# EAGLE design TE2015 Expansion Board (EAGLE 7.7.0)
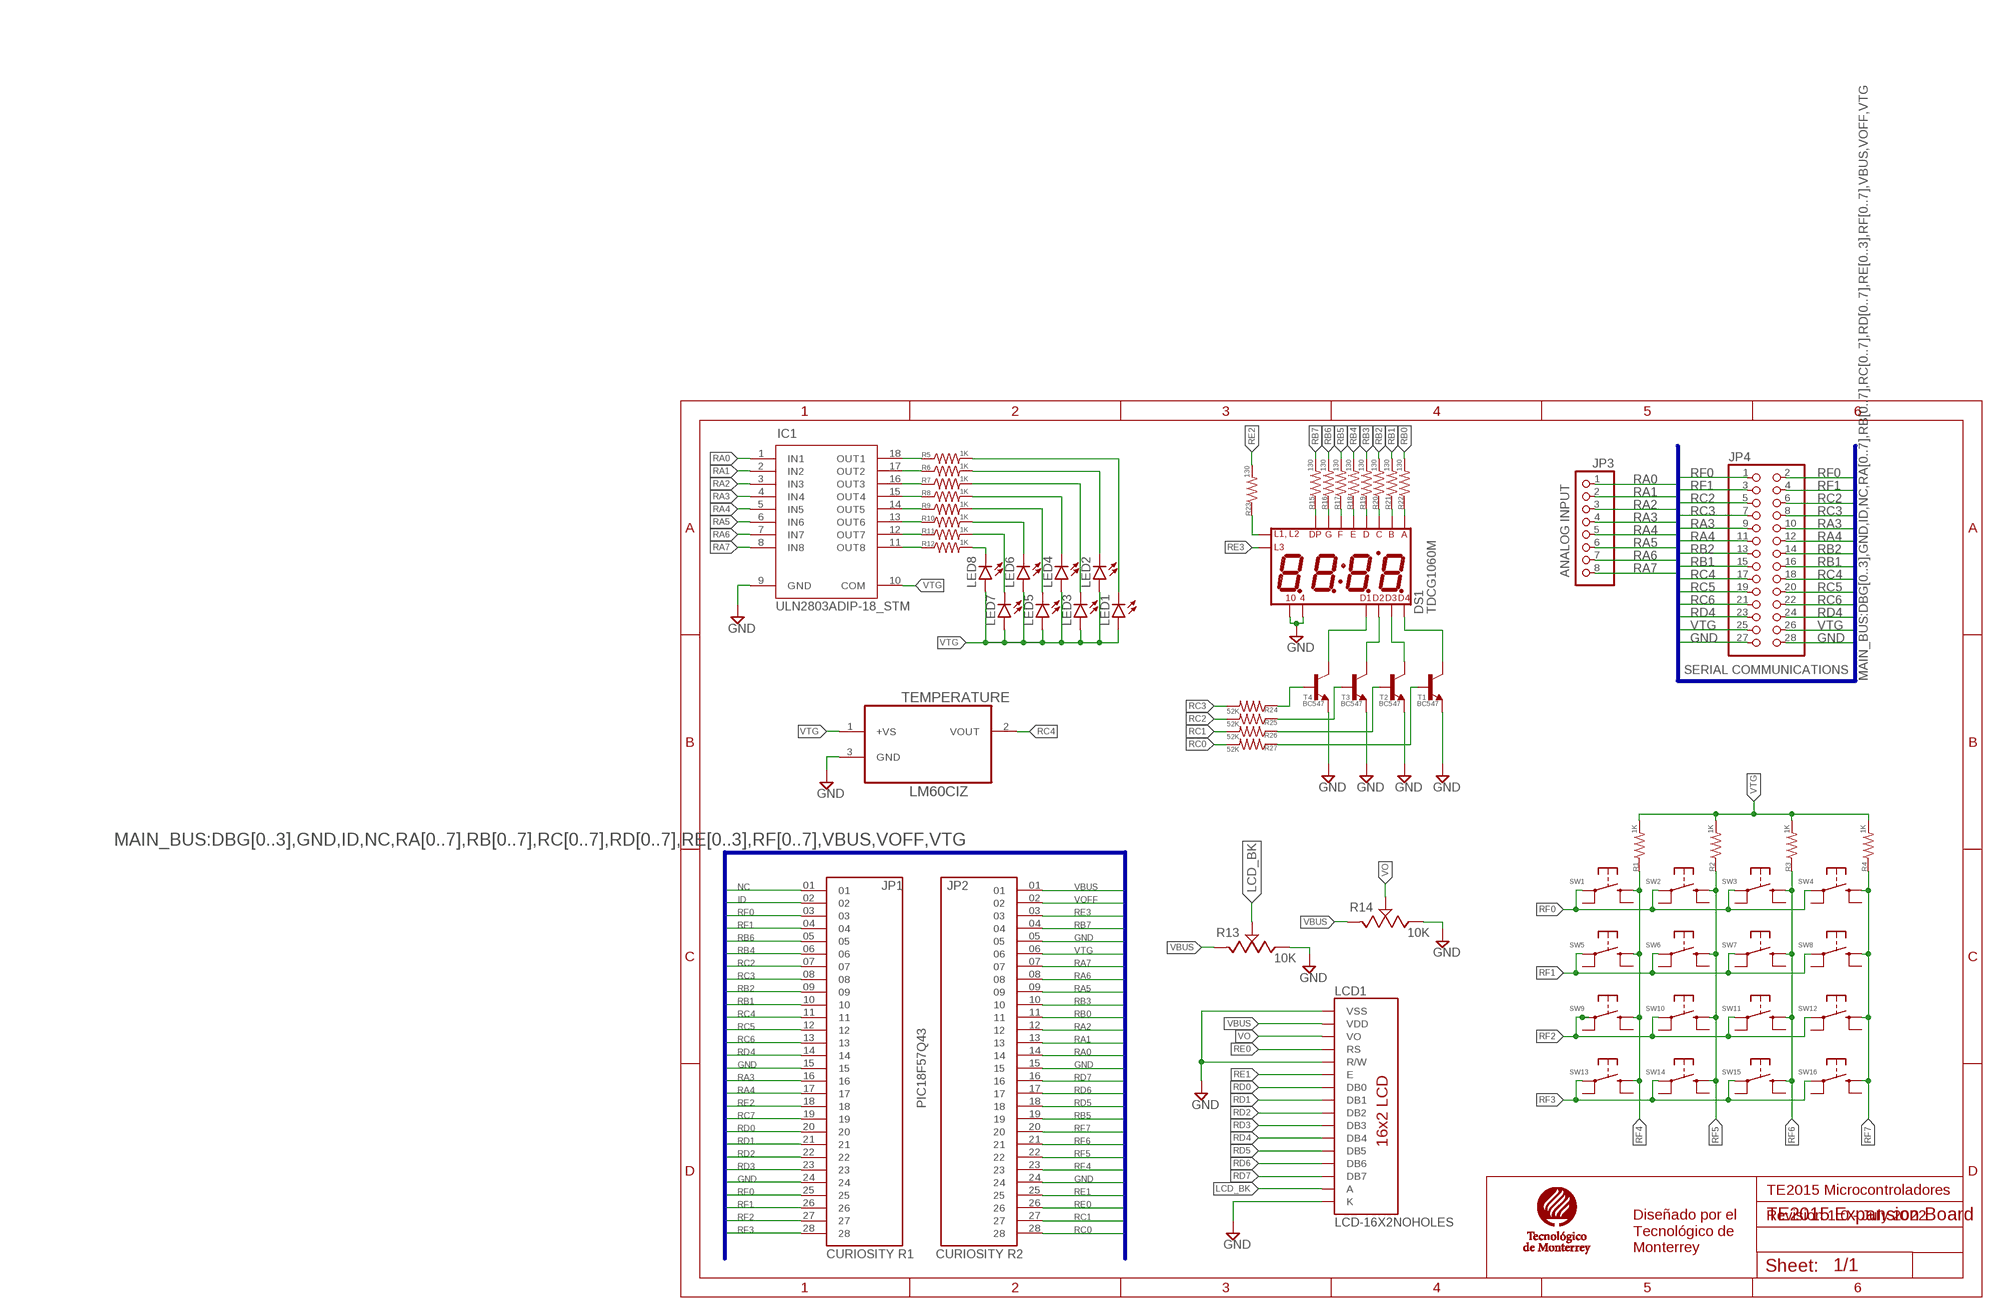
[diagram p0: schematic, sheet 1]

## Parts
DS1  TDCG1060M  [DISPLAY_TDCG1060M]
IC1  ULN2803ADIP-18_STM  [DIP-18_STM]
JP1  CURIOSITY R1  SS-128-T-2  [SAMTEC_SS-128-T-2]
JP2  CURIOSITY R2  SS-128-T-2  [SAMTEC_SS-128-T-2]
JP3  ANALOG INPUT  PINHD-1X8BIG  [1X08-BIG]
JP4  SERIAL COMMUNICATIONS  PINHD-2X14-CB  [2X14-BIG]
LCD1  LCD-16X2NOHOLES  [LCD-16X2_NOHOLESNOSILK]
LED1  LED3MM  [LED3MM]
LED2  LED3MM  [LED3MM]
LED3  LED3MM  [LED3MM]
LED4  LED3MM  [LED3MM]
LED5  LED3MM  [LED3MM]
LED6  LED3MM  [LED3MM]
LED7  LED3MM  [LED3MM]
LED8  LED3MM  [LED3MM]
R1  1K  R-US  [0207/10]
R2  1K  R-US  [0207/10]
R3  1K  R-US  [0207/10]
R4  1K  R-US  [0207/10]
R5  1K  R-US  [0207/10]
R6  1K  R-US  [0207/10]
R7  1K  R-US  [0207/10]
R8  1K  R-US  [0207/10]
R9  1K  R-US  [0207/10]
R10  1K  R-US  [0207/10]
R11  1K  R-US  [0207/10]
R12  1K  R-US  [0207/10]
R13  10K  3362P-1-103LF  [3362P-1-103LF]
R14  10K  3362P-1-103LF  [3362P-1-103LF]
R15  130  R-US  [0207/10]
R16  130  R-US  [0207/10]
R17  130  R-US  [0207/10]
R18  130  R-US  [0207/10]
R19  130  R-US  [0207/10]
R20  130  R-US  [0207/10]
R21  130  R-US  [0207/10]
R22  130  R-US  [0207/10]
R23  130  R-US  [0207/10]
R24  52K  R-US  [0207/10]
R25  52K  R-US  [0207/10]
R26  52K  R-US  [0207/10]
R27  52K  R-US  [0207/10]
SW1  1825910-2  [TE_1825910-2]
SW2  1825910-2  [TE_1825910-2]
SW3  1825910-2  [TE_1825910-2]
SW4  1825910-2  [TE_1825910-2]
SW5  1825910-2  [TE_1825910-2]
SW6  1825910-2  [TE_1825910-2]
SW7  1825910-2  [TE_1825910-2]
SW8  1825910-2  [TE_1825910-2]
SW9  1825910-2  [TE_1825910-2]
SW10  1825910-2  [TE_1825910-2]
SW11  1825910-2  [TE_1825910-2]
SW12  1825910-2  [TE_1825910-2]
SW13  1825910-2  [TE_1825910-2]
SW14  1825910-2  [TE_1825910-2]
SW15  1825910-2  [TE_1825910-2]
SW16  1825910-2  [TE_1825910-2]
T1  BC547  [TO92]
T2  BC547  [TO92]
T3  BC547  [TO92]
T4  BC547  [TO92]
TEC1  TEC_LOGO  [TEC_LOGO]
TEMPERATURE  LM60CIZ  [TO92/]

## Nets
GND [Power]: DS1.4 DS1.10 IC1.9(GND) JP1.15 JP1.24 JP2.05 JP2.15 JP2.24 JP4.27 JP4.28 LCD1.1(VSS) LCD1.5(R/W) LCD1.16(K) R13.3 R14.3 T1.1(E) T2.1(E) T3.1(E) T4.1(E) TEMPERATURE.3(GND)
ID [Signal]: JP1.02
LCD_BK: LCD1.15(A) R13.2
N$1: IC1.18(OUT1) R5.1
N$2: LED8.K(C) R12.2
N$3: LED7.K(C) R11.2
N$4: LED6.K(C) R10.2
N$5: LED5.K(C) R9.2
N$6: LED4.K(C) R8.2
N$7: LED3.K(C) R7.2
N$8: LED2.K(C) R6.2
N$9: DS1.7(DP) R15.1
N$10: DS1.15(G) R16.1
N$11: DS1.11(F) R17.1
N$12: DS1.5(E) R18.1
N$13: DS1.3(D) R19.1
N$14: DS1.13(C) R20.1
N$15: DS1.16(B) R21.1
N$16: DS1.14(A) R22.1
N$17: IC1.17(OUT2) R6.1
N$18: IC1.16(OUT3) R7.1
N$19: LED1.K(C) R5.2
N$20: IC1.15(OUT4) R8.1
N$21: DS1.12(L1_L2) R23.1
N$22: IC1.14(OUT5) R9.1
N$23: IC1.13(OUT6) R10.1
N$24: IC1.12(OUT7) R11.1
N$25: IC1.11(OUT8) R12.1
N$26: DS1.1(DIG1) T4.3(C)
N$27: R24.1 T4.2(B)
N$28: DS1.8(DIG4) T1.3(C)
N$29: DS1.6(DIG3) T2.3(C)
N$30: DS1.2(DIG2) T3.3(C)
N$31: R25.1 T3.2(B)
N$32: R26.1 T2.2(B)
N$33: R27.1 T1.2(B)
NC [Signal]: JP1.01
RA0 [Signal]: IC1.1(IN1) JP2.14 JP3.1
RA1 [Signal]: IC1.2(IN2) JP2.13 JP3.2
RA2 [Signal]: IC1.3(IN3) JP2.12 JP3.3
RA3 [Signal]: IC1.4(IN4) JP1.16 JP3.4 JP4.9 JP4.10
RA4 [Signal]: IC1.5(IN5) JP1.17 JP3.5 JP4.11 JP4.12
RA5 [Signal]: IC1.6(IN6) JP2.09 JP3.6
RA6 [Signal]: IC1.7(IN7) JP2.08 JP3.7
RA7 [Signal]: IC1.8(IN8) JP2.07 JP3.8
RB0 [Signal]: JP2.11 R22.2
RB1 [Signal]: JP1.10 JP4.15 JP4.16 R21.2
RB2 [Signal]: JP1.09 JP4.13 JP4.14 R20.2
RB3 [Signal]: JP2.10 R19.2
RB4 [Signal]: JP1.06 R18.2
RB5 [Signal]: JP2.19 R17.2
RB6 [Signal]: JP1.05 R16.2
RB7 [Signal]: JP2.04 R15.2
RC0 [Signal]: JP2.28 R27.2
RC1 [Signal]: JP2.27 R26.2
RC2 [Signal]: JP1.07 JP4.5 JP4.6 R25.2
RC3 [Signal]: JP1.08 JP4.7 JP4.8 R24.2
RC4 [Signal]: JP1.11 JP4.17 JP4.18 TEMPERATURE.2(VOUT)
RC5 [Signal]: JP1.12 JP4.19 JP4.20
RC6 [Signal]: JP1.13 JP4.21 JP4.22
RC7 [Signal]: JP1.19
RD0 [Signal]: JP1.20 LCD1.7(DB0)
RD1 [Signal]: JP1.21 LCD1.8(DB1)
RD2 [Signal]: JP1.22 LCD1.9(DB2)
RD3 [Signal]: JP1.23 LCD1.10(DB3)
RD4 [Signal]: JP1.14 JP4.23 JP4.24 LCD1.11(DB4)
RD5 [Signal]: JP2.18 LCD1.12(DB5)
RD6 [Signal]: JP2.17 LCD1.13(DB6)
RD7 [Signal]: JP2.16 LCD1.14(DB7)
RE0 [Signal]: JP2.26 LCD1.4(RS)
RE1 [Signal]: JP2.25 LCD1.6(E)
RE2 [Signal]: JP1.18 R23.2
RE3 [Signal]: DS1.9(L3) JP2.03
RF0 [Signal]: JP1.03 JP1.25 JP4.1 JP4.2 SW1.1(P) SW2.1(P) SW3.1(P) SW4.1(P)
RF1 [Signal]: JP1.04 JP1.26 JP4.3 JP4.4 SW5.1(P) SW6.1(P) SW7.1(P) SW8.1(P)
RF2 [Signal]: JP1.27 SW9.1(P) SW10.1(P) SW11.1(P) SW12.1(P)
RF3 [Signal]: JP1.28 SW13.1(P) SW14.1(P) SW15.1(P) SW16.1(P)
RF4 [Signal]: JP2.23 R1.1 SW1.2(S) SW5.2(S) SW9.2(S) SW13.2(S)
RF5 [Signal]: JP2.22 R2.1 SW2.2(S) SW6.2(S) SW10.2(S) SW14.2(S)
RF6 [Signal]: JP2.21 R3.1 SW3.2(S) SW7.2(S) SW11.2(S) SW15.2(S)
RF7 [Signal]: JP2.20 R4.1 SW4.2(S) SW8.2(S) SW12.2(S) SW16.2(S)
VBUS [Power]: JP2.01 LCD1.2(VDD) R13.1 R14.1
VO [Signal]: LCD1.3(VO) R14.2
VOFF [Signal]: JP2.02
VTG [Signal]: IC1.10(COM) JP2.06 JP4.25 JP4.26 LED1.A LED2.A LED3.A LED4.A LED5.A LED6.A LED7.A LED8.A R1.2 R2.2 R3.2 R4.2 TEMPERATURE.1(+VS)
Unconnected: SW1.3(P1) SW1.4(S1) SW2.3(P1) SW2.4(S1) SW3.3(P1) SW3.4(S1) SW4.3(P1) SW4.4(S1) SW5.3(P1) SW5.4(S1) SW6.3(P1) SW6.4(S1) SW7.3(P1) SW7.4(S1) SW8.3(P1) SW8.4(S1) SW9.3(P1) SW9.4(S1) SW10.3(P1) SW10.4(S1) SW11.3(P1) SW11.4(S1) SW12.3(P1) SW12.4(S1) SW13.3(P1) SW13.4(S1) SW14.3(P1) SW14.4(S1) SW15.3(P1) SW15.4(S1) SW16.3(P1) SW16.4(S1)

## Buses
MAIN_BUS:DBG[0..3],GND,ID,NC,RA[0..7],RB[0..7],RC[0..7],RD[0..7],RE[0..3],RF[0..7],VBUS,VOFF,VTG

## Notes on the sheet
- PIC18F57Q43
- TE2015 Microcontroladores
- Revision 1.0 - July 2022
- Diseñado por el 
  Tecnológico de 
  Monterrey

## Library data of the parts
DS1 = TE2015_Microcontroladores:TDCG1060M: Clockmodule 10mm Green m.Plex c.c.-E4; DESCRIPTION: Display Modules - LED Character and Numeric Green 7-Segment Clock 4 Character Common Cathode 2V 20mA 0.504 H x 1.583 W x 0.276 D (12.80mm x 40.20mm x 7.00mm) 16-DIP (0.400, 10.16mm); DIGI-KEY_PART_NUMBER: TDCG1060M-ND; MF: Vishay; MP: TDCG1060M; PACKAGE: None; PURCHASE-URL: https://pricing.snapeda.com/search/part/TDCG1060M/?ref=eda
IC1 = TE2015_Microcontroladores:ULN2803A; COPYRIGHT: Copyright (C) 2022 Ultra Librarian. All rights reserved.; DIGI-KEY_PART_NUMBER_1: 497-2356-5-ND; MANUFACTURER_PART_NUMBER: ULN2803A; MFR_NAME: STMicroelectronics
JP1 JP2 = TE2015_Microcontroladores:SS-128-T-2; DESCRIPTION: 28 Position Receptacle Connector 0.100 (2.54mm) Through Hole Gold; DIGI-KEY_PART_NUMBER: SAM1117-28-ND; MF: Samtec; MP: SS-128-T-2; PACKAGE: None; PURCHASE-URL: https://pricing.snapeda.com/search/part/SS-128-T-2/?ref=eda
JP3 = TE2015_Microcontroladores:PINHD-1X8: PIN HEADER
JP4 = TE2015_Microcontroladores:PINHD-2X14: PIN HEADER
LCD1 = TE2015_Microcontroladores:LCD-16X2: Standard text-only 16x2 parallel input LCD Basic 16 character by 2 line display. Typically utilizes the extremely common HD44780 parallel interface chipset SparkFun Products: Basic 16x2 Green Basic 8x2 Green; SF_ID: LCD-00255
LED1-LED8 = TE2015_Microcontroladores:LED3MM
R1-R12 R15-R27 = TE2015_Microcontroladores:R-US; SPICEPREFIX: R
R13 R14 = TE2015_Microcontroladores:3362P-1-103LF: TRIMMER 10K OHM 0.5W PC PIN TOP Manufacturer's datasheet; CREATED_PN: PCBLayout.com; DIGIKEY_PN: 3362P-103LF-ND; MANUFACTURER: Bourns Inc.; MPN: 3362P-1-103LF
SW1-SW16 = TE2015_Microcontroladores:1825910-2: SWITCH TACTILE SPST-NO 0.05A 24V Check availability; AVAILABILITY: In Stock; COMMENT: 1825910-2; CONFIGURATION_POLE-THROW: Single Pole - Single Throw; CONTACT_CURRENT_RATING: 50 mA; DESCRIPTION: 50 mA SPST Round Actuator 160 Gram Force Tactile Pushbutton Switch; EU_ROHS_COMPLIANCE: Compliant; MF: TE Connectivity; MP: 1825910-2; PACKAGE: None; PRICE: None; PURCHASE-URL: https://pricing.snapeda.com/search/part/1825910-2/?ref=eda
T1-T4 = transistor:BC547: NPN TRANSISTOR
TEC1 = TE2015_Microcontroladores:TEC_LOGO
TEMPERATURE = TE2015_Microcontroladores:LM60CIZ: IC, TEMPERATURE SENSOR, ± 3°C

## Net classes
0 default: width 0.152 mm, drill 0.152 mm, clearance 0.152 mm
1 Power: width 0.305 mm, drill 0.305 mm, clearance 0.305 mm
2 Signal: width 0.152 mm, drill 0.152 mm, clearance 0.152 mm

## Board
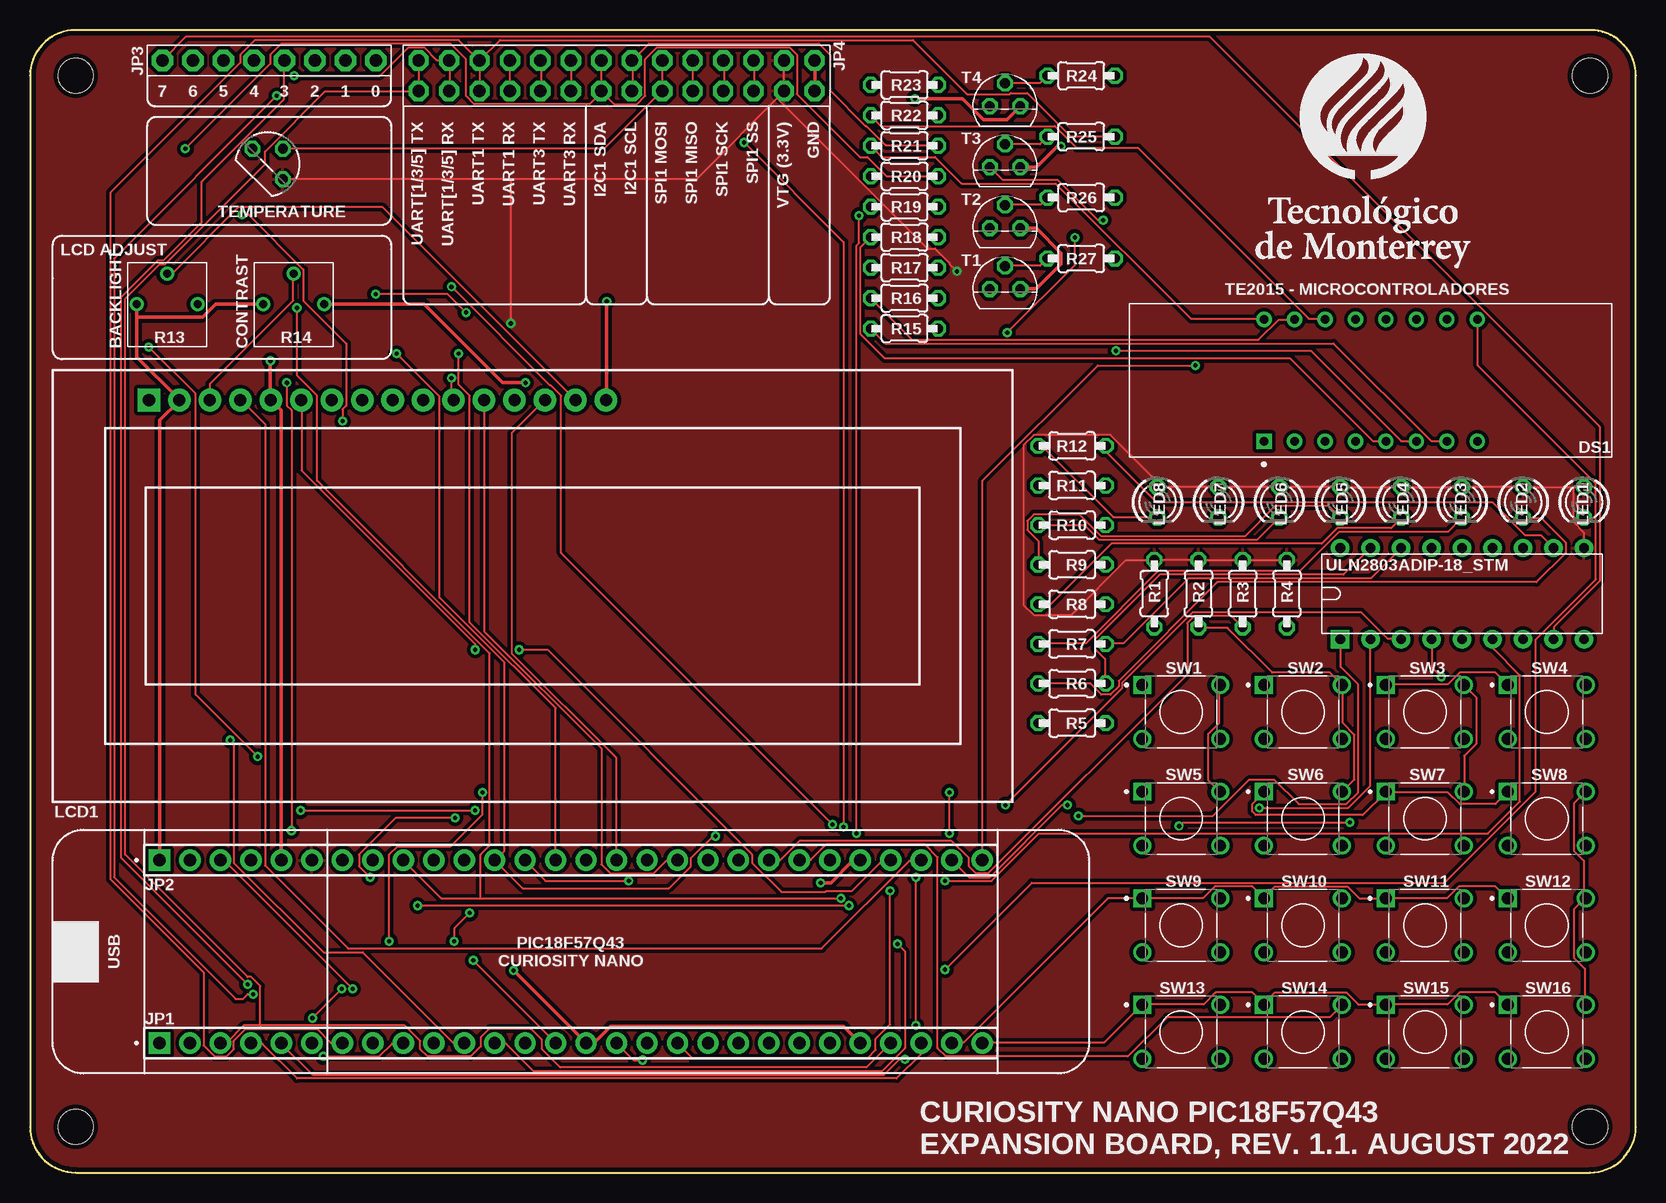
[diagram p1: board, top side]
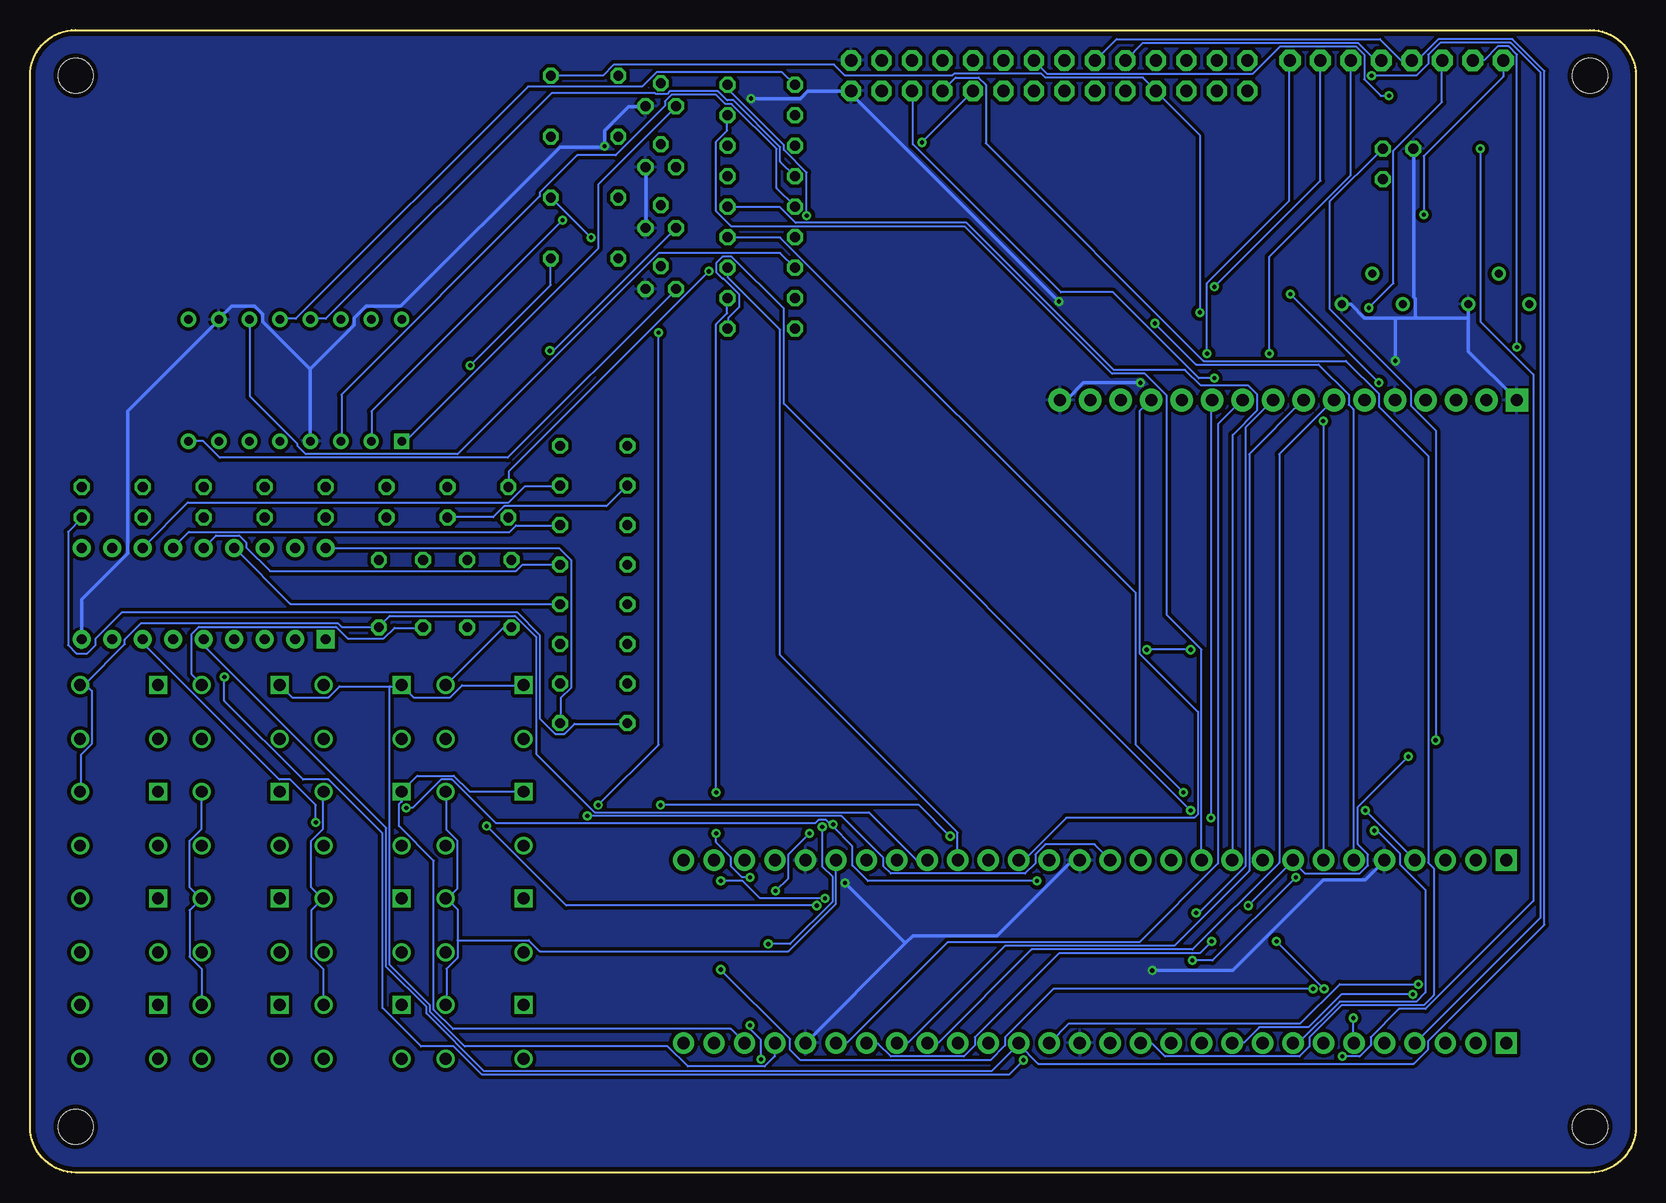
[diagram p2: board, bottom side, seen from below]

Size 133.86 x 95.25 mm. Coordinates in mm from the lower left corner, seen from the top.
Outline: 0,91.44 0,3.81 arc90 3.81,0 130.05,0 130.38,0.01 arc85 133.86,3.81 133.86,91.44 133.84,91.77 arc85 130.05,95.25 3.81,95.25 3.48,95.24 arc85 0,91.44
Copper layers (1*16): Top 0.035mm / dielectric 1.5mm / Bottom 0.035mm
Design rules "default *": minimum track width 6mil, minimum drill 0.35mm, track to track 6mil, track to pad 6mil, pad to pad 6mil, via to via 6mil, smd to smd 6mil, copper to edge 15mil, drill to drill 6mil, minimum pad ring 10mil, minimum via ring 8mil, stop-mask expansion 4mil, vias tented up to drill 0mil, thermal gap 10mil
Holes 2.92 mm at 3.81,3.81 3.81,91.44 130.05,3.81 130.05,91.44

### Footprints (pad centres in the part's own frame; a part is rotated, then mirrored left to right if it is on the bottom)
DISPLAY_TDCG1060M = drill 0.7 pad 1.27 square: 1 -8.89,-5.08 | drill 0.7 pad 1.27: 2 -6.35,-5.08; 3 -3.81,-5.08; 4 -1.27,-5.08; 5 1.27,-5.08; 6 3.81,-5.08; 7 6.35,-5.08; 8 8.89,-5.08; 9 8.89,5.08; 10 6.35,5.08; 11 3.81,5.08; 12 1.27,5.08; 13 -1.27,5.08; 14 -3.81,5.08; 15 -6.35,5.08; 16 -8.89,5.08
DIP-18_STM = drill 0.813 pad 1.524 square: 1 0,0 | drill 0.813 pad 1.524: 2 0,-2.54; 3 0,-5.08; 4 0,-7.62; 5 0,-10.16; 6 0,-12.7; 7 0,-15.24; 8 0,-17.78; 9 0,-20.32; 10 7.62,-20.32; 11 7.62,-17.78; 12 7.62,-15.24; 13 7.62,-12.7; 14 7.62,-10.16; 15 7.62,-7.62; 16 7.62,-5.08; 17 7.62,-2.54; 18 7.62,0
SAMTEC_SS-128-T-2 = drill 1.016 pad 1.778 square: 01 0,0 | drill 1.016 pad 1.778: 02 -2.54,0; 03 -5.08,0; 04 -7.62,0; 05 -10.16,0; 06 -12.7,0; 07 -15.24,0; 08 -17.78,0; 09 -20.32,0; 10 -22.86,0; 11 -25.4,0; 12 -27.94,0; 13 -30.48,0; 14 -33.02,0; 15 -35.56,0; 16 -38.1,0; 17 -40.64,0; 18 -43.18,0; 19 -45.72,0; 20 -48.26,0; 21 -50.8,0; 22 -53.34,0; 23 -55.88,0; 24 -58.42,0; 25 -60.96,0; 26 -63.5,0; 27 -66.04,0; 28 -68.58,0
1X08-BIG = drill 1.016 pad 1.778 octagon: 1 -8.89,0; 2 -6.35,0; 3 -3.81,0; 4 -1.27,0; 5 1.27,0; 6 3.81,0; 7 6.35,0; 8 8.89,0
2X14-BIG = drill 1.016 pad 1.676 octagon: 1 -16.51,-1.27; 2 -16.51,1.27; 3 -13.97,-1.27; 4 -13.97,1.27; 5 -11.43,-1.27; 6 -11.43,1.27; 7 -8.89,-1.27; 8 -8.89,1.27; 9 -6.35,-1.27; 10 -6.35,1.27; 11 -3.81,-1.27; 12 -3.81,1.27; 13 -1.27,-1.27; 14 -1.27,1.27; 15 1.27,-1.27; 16 1.27,1.27; 17 3.81,-1.27; 18 3.81,1.27; 19 6.35,-1.27; 20 6.35,1.27; 21 8.89,-1.27; 22 8.89,1.27; 23 11.43,-1.27; 24 11.43,1.27; 25 13.97,-1.27; 26 13.97,1.27; 27 16.51,-1.27; 28 16.51,1.27
LCD-16X2_NOHOLESNOSILK = drill 1.016 pad 1.88 square: 1 -32,15.5 | drill 1.016 pad 1.88: 2 -29.46,15.5; 3 -26.92,15.5; 4 -24.38,15.5; 5 -21.84,15.5; 6 -19.3,15.5; 7 -16.76,15.5; 8 -14.22,15.5; 9 -11.68,15.5; 10 -9.14,15.5; 11 -6.6,15.5; 12 -4.06,15.5; 13 -1.52,15.5; 14 1.02,15.5; 15 3.56,15.5; 16 6.1,15.5
LED3MM = drill 0.813 octagon: A -1.27,0; K 1.27,0
0207/10 = drill 0.813 octagon: 1 -1.54,0; 2 4.08,0
3362P-1-103LF = drill 0.66: 1 -2.54,0; 2 0,2.54; 3 2.54,0
TE_1825910-2 = drill 0.99 square: 1 0,0 | drill 0.99: 2 6.5,0; 3 0,-4.5; 4 6.5,-4.5
TO92 = drill 0.813 octagon: 1 1.27,0; 2 0,1.905; 3 -1.27,0
TO92/ = drill 0.813 octagon: 1 1.27,-1.27; 2 1.27,1.27; 3 -1.27,1.27

### Placement (x,y rotation side)
DS1  111.76,66.04 0 top
IC1  109.22,44.45 90 top
JP1  10.79,10.79 180 top
JP2  10.79,26.04 180 top
JP3  19.94,92.71 180 top
JP4  48.9,91.44 0 top
LCD1  41.91,48.9 0 top
LED1  129.54,55.88 270 top
LED2  124.46,55.88 270 top
LED3  119.38,55.88 270 top
LED4  114.3,55.88 270 top
LED5  109.22,55.88 270 top
LED6  104.14,55.88 270 top
LED7  99.06,55.88 270 top
LED8  93.98,55.88 270 top
R1  93.73,46.99 90 top
R2  97.41,46.99 90 top
R3  101.09,46.99 90 top
R4  104.78,46.99 90 top
R5  88.14,37.47 180 top
R6  88.14,40.77 180 top
R7  88.14,44.07 180 top
R8  88.14,47.37 180 top
R9  88.14,50.67 180 top
R10  88.14,53.98 180 top
R11  88.14,57.28 180 top
R12  88.14,60.58 180 top
R13  11.43,72.39 0 top
R14  21.97,72.39 0 top
R15  71.63,70.36 0 top
R16  71.63,72.9 0 top
R17  71.63,75.44 0 top
R18  71.63,77.98 0 top
R19  71.63,80.52 0 top
R20  71.63,83.06 0 top
R21  71.63,85.6 0 top
R22  71.63,88.14 0 top
R23  71.63,90.68 0 top
R24  86.36,91.44 0 top
R25  86.36,86.36 0 top
R26  86.36,81.28 0 top
R27  86.36,76.2 0 top
SW1  92.71,40.64 0 top
SW2  102.87,40.64 0 top
SW3  113.03,40.64 0 top
SW4  123.19,40.64 0 top
SW5  92.71,31.75 0 top
SW6  102.87,31.75 0 top
SW7  113.03,31.75 0 top
SW8  123.19,31.75 0 top
SW9  92.71,22.86 0 top
SW10  102.87,22.86 0 top
SW11  113.03,22.86 0 top
SW12  123.19,22.86 0 top
SW13  92.71,13.97 0 top
SW14  102.87,13.97 0 top
SW15  113.03,13.97 0 top
SW16  123.19,13.97 0 top
T1  81.28,73.66 0 top
T2  81.28,78.74 0 top
T3  81.28,83.82 0 top
T4  81.28,88.9 0 top
TEC1  100.97,74.17 0 top
TEMPERATURE  19.81,84.07 0 top

### Tracks (layer width: path | path; a pad name or v marks a point on that pad's centre or on a via)
GND  (via drill 0.35)
  Top 0.305: JP4.27 65.46,90.22 65.46,92.66 JP4.28 | T1.1 82.6,73.69 83.9,73.69 85.95,75.74 85.95,76.66 83.9,78.72 82.6,78.72 T2.1 | v85.95,85.57 85.65,85.57 83.9,83.82 82.6,83.82 T3.1 | v73.76,89.53 77.72,89.53 79.48,87.78 81.46,87.78 82.53,88.85 T4.1 | v41.3,65.84 39.4,65.84 32.84,72.39 24.54,72.39 R14.3 | JP1.24 69.19,10.82 67.82,12.19 48.39,12.19 47.02,10.82 46.41,10.82 JP1.15 46.25,10.9 v40.31,16.84 | v65.91,24.16 66.75,24.16 68.58,25.98 69.19,25.98 JP2.24 | JP2.05 20.95,26.06 20.95,63.55 20.12,64.39 LCD1.5 20.04,64.54 v20.04,67.67 | v48.08,72.62 48.08,64.47 LCD1.16
  Bottom 0.305: T3.1 82.53,83.82 82.53,78.79 T2.1 | T4.1 82.6,88.85 83.97,88.85 85.95,86.87 v85.95,85.57 86.03,85.5 89.69,85.5 102.95,72.24 105.84,72.24 106.83,71.25 106.83,70.64 110.41,67.06 110.49,66.98 | v73.76,89.53 69.65,89.53 69.04,90.14 65.46,90.14 JP4.27 65.46,89.99 v48.08,72.62 | 110.49,66.98 DS1.4 | 110.49,66.98 114.45,70.94 114.45,71.55 115.14,72.24 117.04,72.24 118.11,71.17 DS1.10 118.19,71.02 125.73,63.48 125.73,51.59 129.54,47.78 129.54,44.5 IC1.9 | 13.95,71.25 13.95,68.43 9.98,64.47 LCD1.1 | 13.95,71.25 13.95,72.39 R13.3 | 18.36,71.25 14.02,71.25 13.95,71.25 | 18.36,71.25 20.04,71.25 | 20.04,71.25 22.63,71.25 23.77,72.39 24.46,72.39 R14.3 | TEMPERATURE.3 18.52,85.34 18.52,73 18.36,72.85 18.36,71.32 18.36,71.25 | v41.3,65.84 46.02,65.84 47.4,64.47 48.01,64.47 LCD1.16 | 60.88,19.13 69.19,10.82 JP1.24 | 60.88,19.13 60.27,19.74 53.26,19.74 47.02,25.98 46.41,25.98 JP2.15 | v65.91,24.16 60.96,19.2 60.88,19.13 | v40.31,16.84 33.6,16.84 26.06,24.38 22.55,24.38 20.95,25.98 JP2.05 | v20.04,67.67 20.04,71.17 20.04,71.25
  pour Bottom (isolate 0.305): 0,91.44 arc-90 3.81,95.25 130.05,95.25 arc-90 133.86,91.44 133.86,3.81 arc-90 130.05,0 3.81,0 arc-90 0,3.81
LCD_BK
  Top 0.152: R13.2 11.43,74.98 11.89,74.98 17.37,80.47 29.41,80.47 45.41,64.47 LCD1.15
N$1
  Bottom 0.152: R5.1 89.61,37.49 89.61,39.55 88.77,40.39 88.77,51.05 89.76,52.05 109.19,52.05 IC1.18
N$2
  Top 0.152: LED8.K 93.95,54.63 90.3,54.63 84.35,60.58 84.12,60.58 R12.2
N$3
  Bottom 0.152: LED7.K 99.06,54.63 95.25,54.63 94.34,55.55 85.8,55.55 84.12,57.23 R11.2
N$4
  Top 0.152: R10.2 84.12,53.95 87.94,53.95 89.15,52.73 102.26,52.73 104.09,54.56 LED6.K
N$5
  Top 0.152: R9.2 84.05,52.65 83.13,53.57 83.13,54.33 83.67,54.86 87.48,54.86 89.31,53.03 101.27,53.03 103.78,55.55 108.28,55.55 109.19,54.63 LED5.K
N$6
  Top 0.152: R8.2 84.12,47.4 85.11,47.4 90.14,52.43 107.67,52.43 108.97,53.72 113.46,53.72 114.3,54.56 LED4.K
N$7
  Top 0.152: R7.2 84.12,44.12 88.01,44.12 94.03,50.14 105.84,50.14 109.12,53.42 118.19,53.42 119.33,54.56 LED3.K
N$8
  Top 0.152: R6.2 84.12,40.77 88.39,40.77 89.31,39.85 90.07,39.85 90.75,40.54 90.75,41 98.98,49.23 125.58,49.23 128.02,51.66 128.02,52.5 125.96,54.56 124.51,54.56 LED2.K
N$9
  Top 0.152: DS1.7 116.81,60.96 108.66,69.11 71.32,69.11 70.1,70.33 R15.1
N$10
  Top 0.152: DS1.15 105.39,71.09 104.09,71.09 102.41,69.42 73.53,69.42 70.1,72.85 R16.1
N$11
  Bottom 0.152: DS1.11 115.52,71.09 115.52,64.69 111.56,60.73 111.56,60.58 110.87,59.89 98.22,59.89 81.46,76.66 71.32,76.66 70.1,75.44 R17.1
N$12
  Top 0.152: DS1.5 113,60.96 111.94,60.96 105,67.89 71.25,67.89 69.19,69.95 69.19,77.11 70.03,77.95 R18.1
N$13
  Bottom 0.152: DS1.3 107.9,60.96 107.9,64.85 91.36,81.38 91.36,81.69 88.24,84.81 85.04,84.81 80.92,88.92 80.92,89.31 80.39,89.84 76.66,89.84 75.89,89.08 75.36,89.08 71.63,85.34 71.63,82.07 70.1,80.54 R19.1
N$14
  Bottom 0.152: DS1.13 110.49,71.17 109.19,71.17 90.37,89.99 81.76,89.99 81.69,89.92 80.77,89.92 80.54,90.14 76.5,90.14 75.74,89.38 75.21,89.38 71.32,85.5 71.32,84.28 70.1,83.06 R20.1
N$15
  Top 0.152: DS1.16 102.87,71.17 96.77,71.17 85.5,82.45 77.65,82.45 75.44,84.66 71.02,84.66 70.1,85.57 R21.1
N$16
  Top 0.152: DS1.14 107.9,71.17 106.6,71.17 92.35,85.42 87.25,85.42 85.42,87.25 70.94,87.25 70.1,88.09 R22.1
N$17
  Top 0.152: R6.1 89.61,40.77 89.61,42.82 88.77,43.66 88.77,44.42 94.18,49.84 109.5,49.84 111.71,52.05 IC1.17
N$18
  Top 0.152: R7.1 89.69,44.12 91.14,44.12 96.55,49.53 111.78,49.53 114.3,52.05 IC1.16
N$19
  Bottom 0.152: R5.2 84.12,37.41 88.47,37.41 89.31,36.58 90.07,36.58 91.36,37.87 91.36,44.81 93.27,46.71 126.19,46.71 128.4,44.5 128.4,43.97 129.08,43.28 130,43.28 130.68,43.97 130.68,53.42 129.54,54.56 LED1.K
N$20
  Bottom 0.152: R8.1 89.69,47.4 112.17,47.4 116.81,52.05 IC1.15
N$21
  Bottom 0.152: DS1.12 113,71.17 111.71,71.17 92.35,90.53 82.83,90.53 81.61,91.75 71.17,91.75 70.1,90.68 R23.1
N$22
  Bottom 0.152: R9.1 92.81,50.67 93.34,50.14 113.84,50.14 115.82,52.12 115.82,52.5 116.43,53.11 118.34,53.11 119.33,52.12 IC1.14
N$23
  Bottom 0.152: R10.1 89.69,53.95 93.34,53.95 93.88,53.42 120.62,53.42 121.92,52.12 IC1.13
N$24
  Bottom 0.152: R11.1 89.69,57.23 92.58,57.23 93.95,55.85 120.7,55.85 124.44,52.12 IC1.12
N$25
  Top 0.152: R12.1 89.69,60.12 93.95,55.85 121.92,55.85 124.66,53.11 125.96,53.11 126.95,52.12 IC1.11
N$26
  Bottom 0.152: DS1.1 102.56,60.96 86.49,77.04 86.49,82.37 80.01,88.85 T4.3
N$27
  Top 0.152: T4.2 81.31,90.83 84.2,90.83 R24.1
N$28
  Bottom 0.152: DS1.8 120.62,60.96 119.41,60.96 118.03,59.59 94.03,59.59 80.01,73.61 T1.3
N$29  (via drill 0.35)
  Top 0.152: v90.53,68.5 106.76,68.5 114.3,60.96 115.52,60.96 DS1.6
  Bottom 0.152: v90.53,68.5 90.22,68.5 80.01,78.72 T2.3
N$30  (via drill 0.35)
  Top 0.152: v89.46,79.4 89,79.4 85.65,82.75 81.08,82.75 T3.3
  Bottom 0.152: v89.46,79.4 105.39,63.48 105.39,60.96 DS1.2
N$31
  Top 0.152: T3.2 81.31,85.72 84.2,85.72 84.81,86.33 R25.1
N$32
  Top 0.152: T2.2 81.31,80.7 84.28,80.7 84.81,81.23 R26.1
N$33
  Top 0.152: T1.2 81.31,75.59 84.2,75.59 R27.1
RA0  (via drill 0.35)
  Top 0.152: v87.4,29.72 98.6,29.72 101.65,32.77 103.71,32.77 105.77,30.71 109.73,30.71 110.72,31.7 110.72,40.69 109.27,42.14 109.27,44.42 IC1.1 | v35.74,68.28 35.74,65.68 36.65,64.77 36.65,45.87 43.81,38.71 43.81,26.06 JP2.14
  Bottom 0.152: v87.4,29.72 66.22,29.72 62.71,26.21 62.71,25.53 62.1,24.92 50.9,24.92 50.06,25.76 50.06,26.52 49.23,27.36 45.11,27.36 43.81,26.06 JP2.14 | v35.74,68.28 35.74,74.14 28.88,81 28.88,92.66 JP3.1
RA1  (via drill 0.35)
  Top 0.152: v102.49,30.4 109.88,30.4 111.71,32.23 111.71,44.42 IC1.2 | v49.91,24.31 42.98,24.31 41.3,25.98 JP2.13 | v35.13,73.84 43.36,65.61 43.43,65.61 44.27,64.77 44.27,51.66 v66.9,29.03
  Bottom 0.152: v102.49,30.4 101.96,30.4 99.59,32.77 98.68,32.77 95.02,29.11 68.43,29.11 68.12,29.41 67.51,29.41 67.02,28.92 | 67.02,28.92 65.3,27.2 65.3,25.6 64.01,24.31 v49.91,24.31 | v35.13,73.84 26.29,82.68 26.29,92.66 JP3.2 | v66.9,29.03 66.98,28.96 67.02,28.92
RA2  (via drill 0.35)
  Top 0.152: v81.31,30.63 91.06,40.39 91.06,40.84 96.93,46.71 110.95,46.71 113.16,44.5 114.3,44.5 IC1.3 | v57.15,28.04 56.92,28.04 55.09,26.21 55.09,25.53 53.26,23.7 41.07,23.7 38.79,25.98 JP2.12 38.79,26.06 39.55,26.82 39.55,42.52 34.14,47.93 34.14,64.69 v30.56,68.28
  Bottom 0.152: v81.31,30.63 59.74,30.63 v57.15,28.04 | v30.56,68.28 30.56,76.35 23.77,83.13 23.77,92.66 JP3.3
RA3  (via drill 0.35)
  Top 0.152: JP4.9 42.6,90.22 42.6,92.66 JP4.10 | v117.65,41.3 116.89,42.06 116.89,44.42 IC1.4 | v51.05,9.37 50.29,9.37 48.92,10.74 JP1.16 | v18.14,15.7 7.62,26.21 7.62,73 10.67,76.05 11.12,76.05 14.33,79.25 14.33,82.6 21.18,89.46 21.18,92.66 JP3.4
  Bottom 0.152: JP3.4 21.26,92.73 21.72,92.73 23.16,94.18 41.07,94.18 42.52,92.73 JP4.10 | v117.65,41.3 117.65,39.32 111.1,32.77 108.97,32.77 104.47,28.27 104.47,13.72 101.27,10.52 98.53,10.52 96.16,8.15 52.27,8.15 v51.05,9.37 | v18.14,15.7 24.69,15.7 27.96,12.42 47.24,12.42 48.84,10.82 JP1.16
RA4
  Top 0.152: JP4.11 45.11,90.22 45.11,92.66 JP4.12
  Bottom 0.152: 18.67,92.73 19.58,92.73 21.34,94.49 43.28,94.49 45.03,92.73 JP4.12 | 18.67,92.73 JP3.5 18.67,92.73 | IC1.5 119.33,44.42 119.33,43.89 104.17,28.73 104.17,17.14 100.81,13.79 100.81,13.26 96.01,8.46 53.72,8.46 51.44,10.74 JP1.17 51.44,10.67 49.84,9.07 18.52,9.07 17.3,10.29 17.3,10.97 7.62,20.65 7.62,91.82 10.29,94.49 16.46,94.49 18.21,92.73 18.67,92.73
RA5  (via drill 0.35)
  Top 0.152: v76.28,24.31 80.16,24.31 84.12,28.27 121.54,28.27 124.21,30.94 124.21,41.45 121.92,43.74 121.92,44.42 IC1.6 | 37.57,22.86 34.29,22.86 31.17,25.98 JP2.09 | 37.57,22.86 v67.59,22.86 | v22.25,72.08 22.25,66.45 23.93,64.77 23.93,57.68 38.33,43.28 38.33,27.28 37.57,26.52 37.57,22.86
  Bottom 0.152: v76.28,24.31 74.45,24.31 73,22.86 v67.59,22.86 | v22.25,72.08 20.19,74.14 20.19,85.19 16.15,89.23 16.15,92.66 JP3.6
RA6  (via drill 0.35)
  Top 0.152: v110.03,29.18 96.09,29.18 v95.78,28.88 | v32.31,22.25 v68.28,22.25 | v9.91,68.81 13.79,64.92 13.79,39.85 v18.97,34.67
  Bottom 0.152: v110.03,29.18 110.03,30.63 112.17,32.77 113.08,32.77 124.44,44.12 124.44,44.42 IC1.7 | v95.78,28.88 89.15,22.25 v68.28,22.25 | v32.31,22.25 28.57,25.98 JP2.08 28.57,25.91 27.58,24.92 23.01,24.92 22.33,25.6 22.33,26.52 23.16,27.36 23.16,30.48 v18.97,34.67 | v9.91,68.81 9.91,93.19 10.59,93.88 11.51,93.88 12.65,92.73 13.56,92.73 JP3.7
RA7  (via drill 0.35)
  Top 0.152: IC1.8 127.03,44.5 127.03,45.49 130.84,49.3 130.84,62.18 98.3,94.72 13.03,94.72 11.05,92.73 JP3.8 | v26.06,62.64 26.06,63.63 26.36,63.93 26.36,69.11 22.78,72.69 22.78,75.29 18.21,79.86 v17.68,79.86
  Bottom 0.152: v26.06,62.64 26.06,26.06 JP2.07 | v17.68,79.86 17.68,84.73 11.05,91.36 11.05,92.66 JP3.8
RB0
  Bottom 0.152: R22.2 75.74,88.09 75.74,86.87 76.66,85.95 76.66,80.16 75.36,78.87 55.93,78.87 43.66,66.6 40.92,66.6 39.09,64.77 39.09,46.48 36.2,43.59 36.2,26.06 JP2.11
RB1  (via drill 0.35)
  Top 0.152: R21.2 75.67,85.65 71.32,85.65 69.72,87.25 69.65,87.25 66.67,90.22 66.67,93.19 65.76,94.11 51.59,94.11 50.22,92.73 JP4.16 50.22,92.66 50.22,90.22 JP4.15 | v18.59,14.86 18.14,14.86 17.75,14.48 17.14,14.48 7.01,24.61 7.01,76.2 v20.57,89.76
  Bottom 0.152: v18.59,14.86 24.54,14.86 27.28,12.12 31.39,12.12 32.69,10.82 33.6,10.82 JP1.10 | v20.57,89.76 21.26,89.76 22.63,91.14 22.63,93.19 23.32,93.88 29.64,93.88 31.93,91.59 49.07,91.59 50.14,92.66 JP4.16
RB2  (via drill 0.35)
  Top 0.152: R20.2 75.67,83.06 71.4,83.06 69.8,84.66 69.19,84.66 63.93,89.92 63.93,93.19 63.32,93.8 52.27,93.8 51.28,92.81 51.28,89.76 50.6,89.08 48.69,89.08 47.62,90.14 JP4.13 | JP4.14 47.62,92.66 47.62,90.22 JP4.13 | v24.46,9.68 29.11,9.68 30.18,10.74 31.09,10.74 JP1.09 | v12.95,85.34 20.04,92.43 20.04,93.19 20.95,94.11 35.05,94.11 36.35,92.81 36.35,89.76 37.03,89.08 46.63,89.08 47.62,90.07 JP4.13
  Bottom 0.152: v24.46,9.68 23.01,9.68 22.1,10.59 22.1,11.28 19.74,13.64 17.53,13.64 8.53,22.63 8.53,66.52 12.95,70.94 v12.95,85.34
RB3
  Bottom 0.152: R19.2 75.67,80.47 71.32,80.47 70.03,79.17 55.78,79.17 43.51,66.9 37.57,66.9 36.27,65.61 32.31,65.61 31.55,64.85 31.55,63.55 33.6,61.49 33.6,26.06 JP2.10
RB4  (via drill 0.35)
  Top 0.152: v37.72,31.7 37.72,29.87 35.05,27.2 30.63,27.2 29.95,26.52 v29.95,19.28 | v23.55,12.88 v25.98,15.32
  Bottom 0.152: v37.72,31.7 41.68,35.66 41.68,48.31 71.32,77.95 75.67,77.95 R18.2 | v25.98,15.32 v29.95,19.28 | v23.55,12.88 23.55,10.82 JP1.06
RB5
  Bottom 0.152: R17.2 75.67,75.44 75.67,74.6 71.32,70.26 71.32,43.13 56.54,28.35 56.54,26.06 JP2.19
RB6  (via drill 0.35)
  Top 0.152: v76.66,28.27 v76.66,31.7 | v73.84,12.27 v73.84,24.61 | v72.92,9.45 72.47,9.45 71.17,8.15 23.55,8.15 20.95,10.74 JP1.05
  Bottom 0.152: v76.66,31.7 76.66,70.71 75.74,71.63 75.74,72.85 R16.2 | v76.66,28.27 76.66,27.51 75.44,26.29 75.44,25.53 74.52,24.61 v73.84,24.61 | v73.84,12.27 73.84,11.96 72.92,11.05 v72.92,9.45
RB7  (via drill 0.35)
  Top 0.152: v22.55,30.18 v37.11,30.18
  Bottom 0.152: v37.11,30.18 71.02,64.08 71.02,72.01 75.36,76.35 76.12,76.35 76.66,75.82 76.66,75.06 76.12,74.52 76.05,74.52 74.75,73.23 74.75,72.16 75.67,71.25 75.67,70.41 R15.2 | v22.55,30.18 18.44,26.06 JP2.04
RC0  (via drill 0.35)
  Top 0.152: v97.16,67.28 89,67.28 79.4,57.68 79.4,26.06 JP2.28
  Bottom 0.152: v97.16,67.28 90.45,73.99 R27.2
RC1  (via drill 0.35)
  Top 0.152: v87.1,77.95 87.1,75.67 v81.46,70.03 | v86.49,30.63 86.03,30.63 80.01,24.61 78.26,24.61 76.89,25.98 JP2.27
  Bottom 0.152: v87.1,77.95 90.37,81.23 R26.2 | v81.46,70.03 81.46,35.66 v86.49,30.63
RC2
  Top 0.152: R25.2 90.37,86.41 86.72,86.41 83.13,89.99 81.76,89.99 81.69,89.92 78.11,89.92 73.61,94.41 39.17,94.41 37.49,92.73 JP4.6 | JP4.5 37.49,90.22 37.49,92.66 JP4.6 | JP1.07 25.98,10.82 25.07,10.82 23.93,11.96 17.98,11.96 16.99,10.97 16.99,10.29 16.38,9.68 15.39,9.68 14.48,10.59 14.48,16.69 6.71,24.46 6.71,81.69 17.53,92.51 17.53,93.19 18.75,94.41 35.74,94.41 37.41,92.73 JP4.6
RC3  (via drill 0.35)
  Top 0.152: JP4.8 40.01,92.66 40.01,90.22 JP4.7 | v21.79,28.5 21.79,63.55 21.41,63.93 v21.41,65.84 | v28.8,73.23 34.82,73.23 v36.35,71.7
  Bottom 0.152: R24.2 90.37,91.44 86.11,91.44 85.19,92.35 66.83,92.35 65.91,91.44 57,91.44 56.84,91.59 49.53,91.59 49.23,91.29 41.07,91.29 40.01,90.22 JP4.7 40.01,90.14 36.35,86.49 v36.35,71.7 | v21.79,28.5 21.57,28.5 19.66,26.59 19.66,25.68 17.53,23.55 17.53,15.01 18.29,14.25 24.69,14.25 28.12,10.82 28.57,10.82 JP1.08 | v28.8,73.23 v21.41,65.84
RC4  (via drill 0.35)
  Top 0.152: TEMPERATURE.2 21.11,85.34 47.85,85.34 52.65,90.14 JP4.17 52.73,90.22 52.73,92.66 JP4.18 | v16.69,36.04 16.99,35.74 16.99,25.83 24.46,18.36 27.74,18.36 35.28,10.82 36.2,10.82 JP1.11
  Bottom 0.152: v16.69,36.04 16.69,61.87 18.75,63.93 18.75,65.23 25.53,72.01 25.53,80.92 21.11,85.34 TEMPERATURE.2
RC5  (via drill 0.35)
  Top 0.152: JP4.19 55.24,90.22 55.24,92.66 JP4.20 | v72.31,19.05 72.92,18.44 72.92,10.36 71.02,8.46 41.99,8.46 39.7,10.74 38.79,10.74 JP1.12 | v67.82,28.8 67.82,77.57 v59.51,85.88
  Bottom 0.152: v72.31,19.05 70.48,19.05 66.98,22.55 66.98,24.69 67.82,25.53 v67.82,28.8 | v59.51,85.88 55.24,90.14 JP4.19
RC6
  Top 0.152: JP4.21 57.84,90.22 57.84,92.66 JP4.22
  Bottom 0.152: JP1.13 41.22,10.74 40.31,10.74 39.24,9.68 28.04,9.68 27.2,10.52 27.2,11.28 24.54,13.95 17.68,13.95 16.84,14.78 16.84,25.38 17.3,25.83 17.3,59.74 21.41,63.86 21.41,64.92 24.16,67.67 36.04,67.67 54.18,85.8 54.18,90.68 54.79,91.29 56.69,91.29 57.76,90.22 JP4.21
RD0
  Bottom 0.152: JP1.20 59.05,10.82 58.14,10.82 50.37,18.59 36.96,18.59 29.72,25.83 29.72,59.89 25.22,64.39 LCD1.7
RD1
  Bottom 0.152: JP1.21 61.57,10.82 60.66,10.82 52.58,18.9 38.48,18.9 32.23,25.15 32.23,59.89 27.74,64.39 LCD1.8
RD2  (via drill 0.35)
  Top 0.152: v35.36,19.28 35.36,20.34 v36.65,21.64
  Bottom 0.152: v35.36,19.28 36.35,18.29 48.08,18.29 55.09,11.28 55.09,10.59 56.01,9.68 62.1,9.68 63.17,10.74 64.08,10.74 JP1.22 | v36.65,21.64 36.42,21.64 32.54,25.53 32.54,62.1 30.25,64.39 LCD1.9
RD3
  Bottom 0.152: JP1.23 66.67,10.82 65.76,10.82 57.38,19.2 41.38,19.2 34.82,25.76 34.82,62.41 32.84,64.39 LCD1.10
RD4  (via drill 0.35)
  Top 0.152: JP4.23 60.35,90.22 60.35,92.66 JP4.24 | v36.96,17.68 43.81,10.82 JP1.14 | v28.35,24.61 27.43,25.53 27.43,26.52 30.48,29.57 v35.43,29.57 | v35.13,66.22 35.13,64.62 35.28,64.47 LCD1.11
  Bottom 0.152: v36.96,17.68 35.28,17.68 v28.35,24.61 | v35.43,29.57 35.43,64.31 35.36,64.39 LCD1.11 | v35.13,66.22 36.42,66.22 43.59,73.38 47.93,73.38 60.27,85.72 60.27,90.14 JP4.23
RD5
  Top 0.152: JP2.18 53.95,25.98 53.03,25.98 51.97,24.92 48.39,24.92 47.62,25.68 47.62,35.36 37.87,45.11 37.87,64.39 LCD1.12
RD6
  Bottom 0.152: JP2.17 51.44,26.06 50.98,26.06 47.47,29.57 36.8,29.57 36.5,29.87 36.5,38.41 41.38,43.28 41.38,63.48 40.46,64.39 LCD1.13
RD7
  Top 0.152: JP2.16 48.84,26.06 48.84,34.59 40.16,43.28 40.16,61.65 42.9,64.39 LCD1.14
RE0
  Top 0.152: JP2.26 74.3,25.98 73.3,25.98 65.99,18.67 26.52,18.67 19.58,25.6 19.58,62.41 17.6,64.39 LCD1.4
RE1  (via drill 0.35)
  Top 0.152: v40.77,43.59 43.13,43.59 60.2,26.52 60.2,25.83 62.64,23.39 66.29,23.39 66.37,23.47 68.5,23.47 71.02,25.98 71.7,25.98 JP2.25 | v37.11,43.59 37.11,44.04 22.63,58.52 22.63,64.39 LCD1.6
  Bottom 0.152: v37.11,43.59 v40.77,43.59
RE2  (via drill 0.35)
  Top 0.152: v69.11,79.78 69.11,77.5 68.89,77.27 v68.89,28.27 | v71.7,23.47 71.7,12.34 70.48,11.12 70.48,10.21 69.8,9.53 55.24,9.53 54.03,10.74 JP1.18
  Bottom 0.152: v69.11,79.78 69.11,83.36 71.02,85.27 71.02,85.65 75.67,90.3 75.67,90.68 R23.2 | v68.89,28.27 70.64,26.52 70.64,24.54 v71.7,23.47
RE3  (via drill 0.35)
  Top 0.152: v76.28,16.92 83.52,24.16 117.88,24.16 125.5,31.77 125.5,44.42 130.53,49.45 130.53,57.45 120.7,67.28 120.7,71.09 DS1.9 | v26.9,15.32 16.23,25.98 15.93,25.98 JP2.03
  Bottom 0.152: v76.28,16.92 70.48,11.12 70.48,10.21 69.65,9.37 53.8,9.37 52.58,10.59 52.58,11.28 48.54,15.32 v26.9,15.32
RF0
  Top 0.152: SW3.1 113.08,40.69 118.19,40.69 119.18,41.68 122.15,41.68 123.14,40.69 SW4.1 | JP4.2 32.38,92.66 32.38,90.22 JP4.1 32.38,90.14 24.61,90.14 19.58,85.11 19.58,84.05 11.28,75.74 10.82,75.74 7.92,72.85 7.92,26.52 18.14,16.31 18.44,16.31 19.2,15.54 19.2,12.27 | 19.2,12.27 31.24,12.27 32.54,10.97 32.54,10.29 33.15,9.68 36.73,9.68 37.57,10.52 37.57,11.28 38.25,11.96 41.76,11.96 42.67,11.05 42.67,10.29 44.2,8.76 69.72,8.76 71.7,10.74 JP1.25 | 19.2,12.27 17.83,12.27 16.38,10.82 15.93,10.82 JP1.03
  Bottom 0.152: SW1.1 92.73,40.62 97.84,40.62 98.83,39.62 101.88,39.62 102.87,40.62 SW2.1 102.87,40.54 103.86,40.54 | 103.86,40.54 108.05,40.54 108.97,39.62 112.01,39.62 113,40.62 SW3.1 | 103.86,40.54 103.86,17.3 100.51,13.95 100.51,13.41 97.61,10.52 80.7,10.52 79.02,8.84 72.62,8.84 71.78,9.68 71.78,10.74 JP1.25
RF1  (via drill 0.35)
  Top 0.152: SW8.1 123.14,31.7 122.15,30.71 119.18,30.71 118.19,31.7 113.08,31.7 SW7.1 113,31.7 111.1,29.79 102.18,29.79 101.88,30.1 101.88,30.71 102.87,31.7 SW6.1 | JP4.3 34.98,90.22 34.98,92.66 JP4.4 34.9,92.73 33.91,92.73 32.84,93.8 31.55,93.8 29.18,91.44 v22.02,91.44 | JP1.04 18.44,10.74 19.36,10.74 22.25,7.85 72.24,7.85 74.3,9.91 74.3,10.74 JP1.26
  Bottom 0.152: SW5.1 92.73,31.77 97.23,31.77 98.53,33.07 101.58,33.07 102.87,31.77 SW6.1 102.87,31.7 102.87,30.94 103.1,30.71 103.1,28.88 100.2,25.98 100.2,13.56 98.6,11.96 75.44,11.96 74.3,10.82 JP1.26 | v22.02,91.44 18.29,91.44 17.3,92.43 17.3,93.19 16.31,94.18 10.44,94.18 7.92,91.67 7.92,21.26 18.36,10.82 JP1.04
RF2
  Top 0.152: SW12.1 123.14,22.86 122.15,23.85 119.1,23.85 118.11,22.86 113.08,22.86 SW11.1 113,22.86 110.8,22.86 109.8,23.85 103.78,23.85 102.87,22.94 SW10.1 101.88,23.85 98.75,23.85 97.77,22.86 92.73,22.86 SW9.1 92.66,22.86 89.84,22.86 77.8,10.82 76.89,10.82 JP1.27
RF3
  Top 0.152: SW16.1 123.14,14.02 122.15,15.01 119.18,15.01 118.19,14.02 113.08,14.02 SW15.1 113,14.02 110.72,14.02 109.73,15.01 103.78,15.01 102.87,14.1 SW14.1 102.87,14.02 101.88,15.01 98.83,15.01 97.84,14.02 92.73,14.02 SW13.1 92.66,13.95 89.53,10.82 79.4,10.82 JP1.28
RF4
  Top 0.152: SW1.2 99.14,40.62 99.14,37.49 98.22,36.58 98.22,32.69 99.14,31.77 SW5.2
  Bottom 0.152: R1.1 93.73,45.41 94.41,45.41 99.14,40.69 SW1.2 | 98.22,19.36 98.22,21.95 99.14,22.86 SW9.2 99.06,22.86 98.22,23.7 98.22,27.66 99.14,28.57 99.14,31.7 SW5.2 | 98.22,19.36 98.22,17.91 99.14,16.99 99.14,14.02 SW13.2 | 98.22,19.36 92.28,19.36 91.36,18.44 70.64,18.44 66.67,22.4 66.67,25.98 JP2.23
RF5
  Top 0.152: R2.1 97.46,45.41 99.82,45.41 103.56,41.68 108.36,41.68 109.35,40.69 SW2.2 109.42,40.62 109.42,37.49 110.41,36.5 110.41,32.77 109.42,31.77 SW6.2 | JP2.22 64.16,26.06 65.08,26.06 66.37,27.36 74.6,27.36 75.67,26.29 75.67,10.36 76.35,9.68 91.52,9.68 94.79,12.95 108.36,12.95 109.35,13.95 SW14.2
  Bottom 0.152: SW14.2 109.42,14.02 109.42,16.99 110.41,17.98 110.41,21.87 109.42,22.86 SW10.2 109.5,22.86 110.41,23.77 110.41,27.66 109.42,28.65 109.42,31.7 SW6.2
RF6
  Top 0.152: JP2.21 61.65,26.06 62.56,26.06 64.16,27.66 76.81,27.66 78.26,26.21 78.26,25.53 78.87,24.92 79.86,24.92 96.47,41.53 96.47,45.8 97.08,46.41 100.13,46.41 101.04,45.49 R3.1 | SW7.2 119.56,31.77 119.56,34.75 120.55,35.74 120.55,39.62 119.56,40.62 SW3.2
  Bottom 0.152: SW15.2 119.56,14.02 119.56,16.99 120.55,17.98 120.55,21.87 119.56,22.86 SW11.2 119.63,22.86 120.55,23.77 120.55,27.66 119.56,28.65 119.56,31.7 SW7.2 | R3.1 101.12,45.41 103.48,45.41 104.39,44.5 107.37,44.5 108.36,45.49 119.79,45.49 120.4,44.88 120.4,41.53 119.56,40.69 SW3.2
RF7
  Top 0.152: SW16.2 129.62,14.02 129.62,16.99 128.7,17.91 128.7,21.95 129.62,22.86 SW12.2 129.54,22.86 129.54,25.98 128.7,26.82 128.7,30.79 129.62,31.7 SW8.2
  Bottom 0.152: 104.78,45.49 107.9,45.49 108.2,45.8 124.59,45.8 125.96,44.42 125.96,44.04 129.31,40.69 129.62,40.69 SW4.2 129.24,40.69 128.7,40.16 128.7,35.74 129.62,34.82 129.62,31.77 SW8.2 | 104.78,45.49 R4.1 104.78,45.49 | 104.78,45.49 103.86,46.41 93.42,46.41 91.67,44.65 91.67,34.9 86.79,30.02 63.93,30.02 59.97,26.06 59.05,26.06 JP2.20
VBUS
  Top 0.305: 8.91,71.32 8.91,67.97 12.42,64.47 LCD1.2 12.42,64.31 10.82,62.71 10.82,26.06 JP2.01 | 8.91,71.32 8.91,72.39 R13.1 | R14.1 15.47,72.39 14.4,71.32 8.99,71.32 8.91,71.32
VO
  Top 0.152: R14.2 21.95,74.91 21.95,72.69 15.01,65.76 15.01,64.47 LCD1.3
VTG  (via drill 0.35)
  Top 0.152: 128.63,57.15 124.51,57.15 LED2.A 124.44,57.15 119.41,57.15 LED3.A 119.33,57.15 LED4.A 109.27,57.15 LED5.A 109.19,57.15 104.17,57.15 LED6.A 104.09,57.15 LED7.A 94.03,57.15 LED8.A 93.95,57.15 93.95,57.61 90.07,61.49 83.67,61.49 82.83,60.66 82.83,47.32 83.67,46.48 86.79,46.48 91.36,51.05 93.73,51.05 | 128.63,57.15 LED1.A | 128.63,57.15 128.63,54.25 129.54,53.34 129.54,52.12 IC1.10 | 93.73,51.05 97.38,51.05 R2.2 97.46,51.05 101.04,51.05 R3.2 101.12,51.05 104.78,51.05 R4.2 | 93.73,51.05 R1.2 93.73,51.05 | 40.08,82.83 55.55,82.83 62.87,90.14 JP4.25 | 40.08,82.83 21.11,82.83 TEMPERATURE.1 | JP4.26 62.87,92.66 62.87,90.22 JP4.25 | 40.08,82.83 v40.08,70.79 | v77.27,75.13 76.66,75.74 76.66,75.82 75.44,77.04 74.83,77.04 62.33,89.53 JP4.25
  Bottom 0.152: v40.08,70.79 36.65,67.36 26.44,67.36 23.93,64.85 23.93,64.01 23.55,63.63 23.55,26.06 JP2.06 | v77.27,75.13 93.95,58.45 93.95,57.15 LED8.A
  pour Top (isolate 0.305): 0,91.44 arc-90 3.81,95.25 130.05,95.25 arc-90 133.86,91.44 133.86,3.81 arc-90 130.05,0 3.81,0 arc-90 0,3.81

### Text on the board
tPlace: 7 | 6 | 5 | 4 | 3 | 2 | 1 | 0 | UART[1/3/5] TX | UART[1/3/5] RX | UART1 TX | UART1 RX | UART3 TX | UART3 RX | I2C1 SDA | I2C1 SCL | SPI1 MOSI | SPI1 MISO | SPI1 SCK | SPI1 SS | VTG (3.3V) | GND | LCD ADJUST | TE2015 - MICROCONTROLADORES | BACKLIGHT | CONTRAST | USB | PIC18F57Q43 / CURIOSITY NANO | CURIOSITY NANO PIC18F57Q43 / EXPANSION BOARD, REV. 1.1. AUGUST 2022